# Altium project WanderDrive.PrjPcb (part 1 of 5)
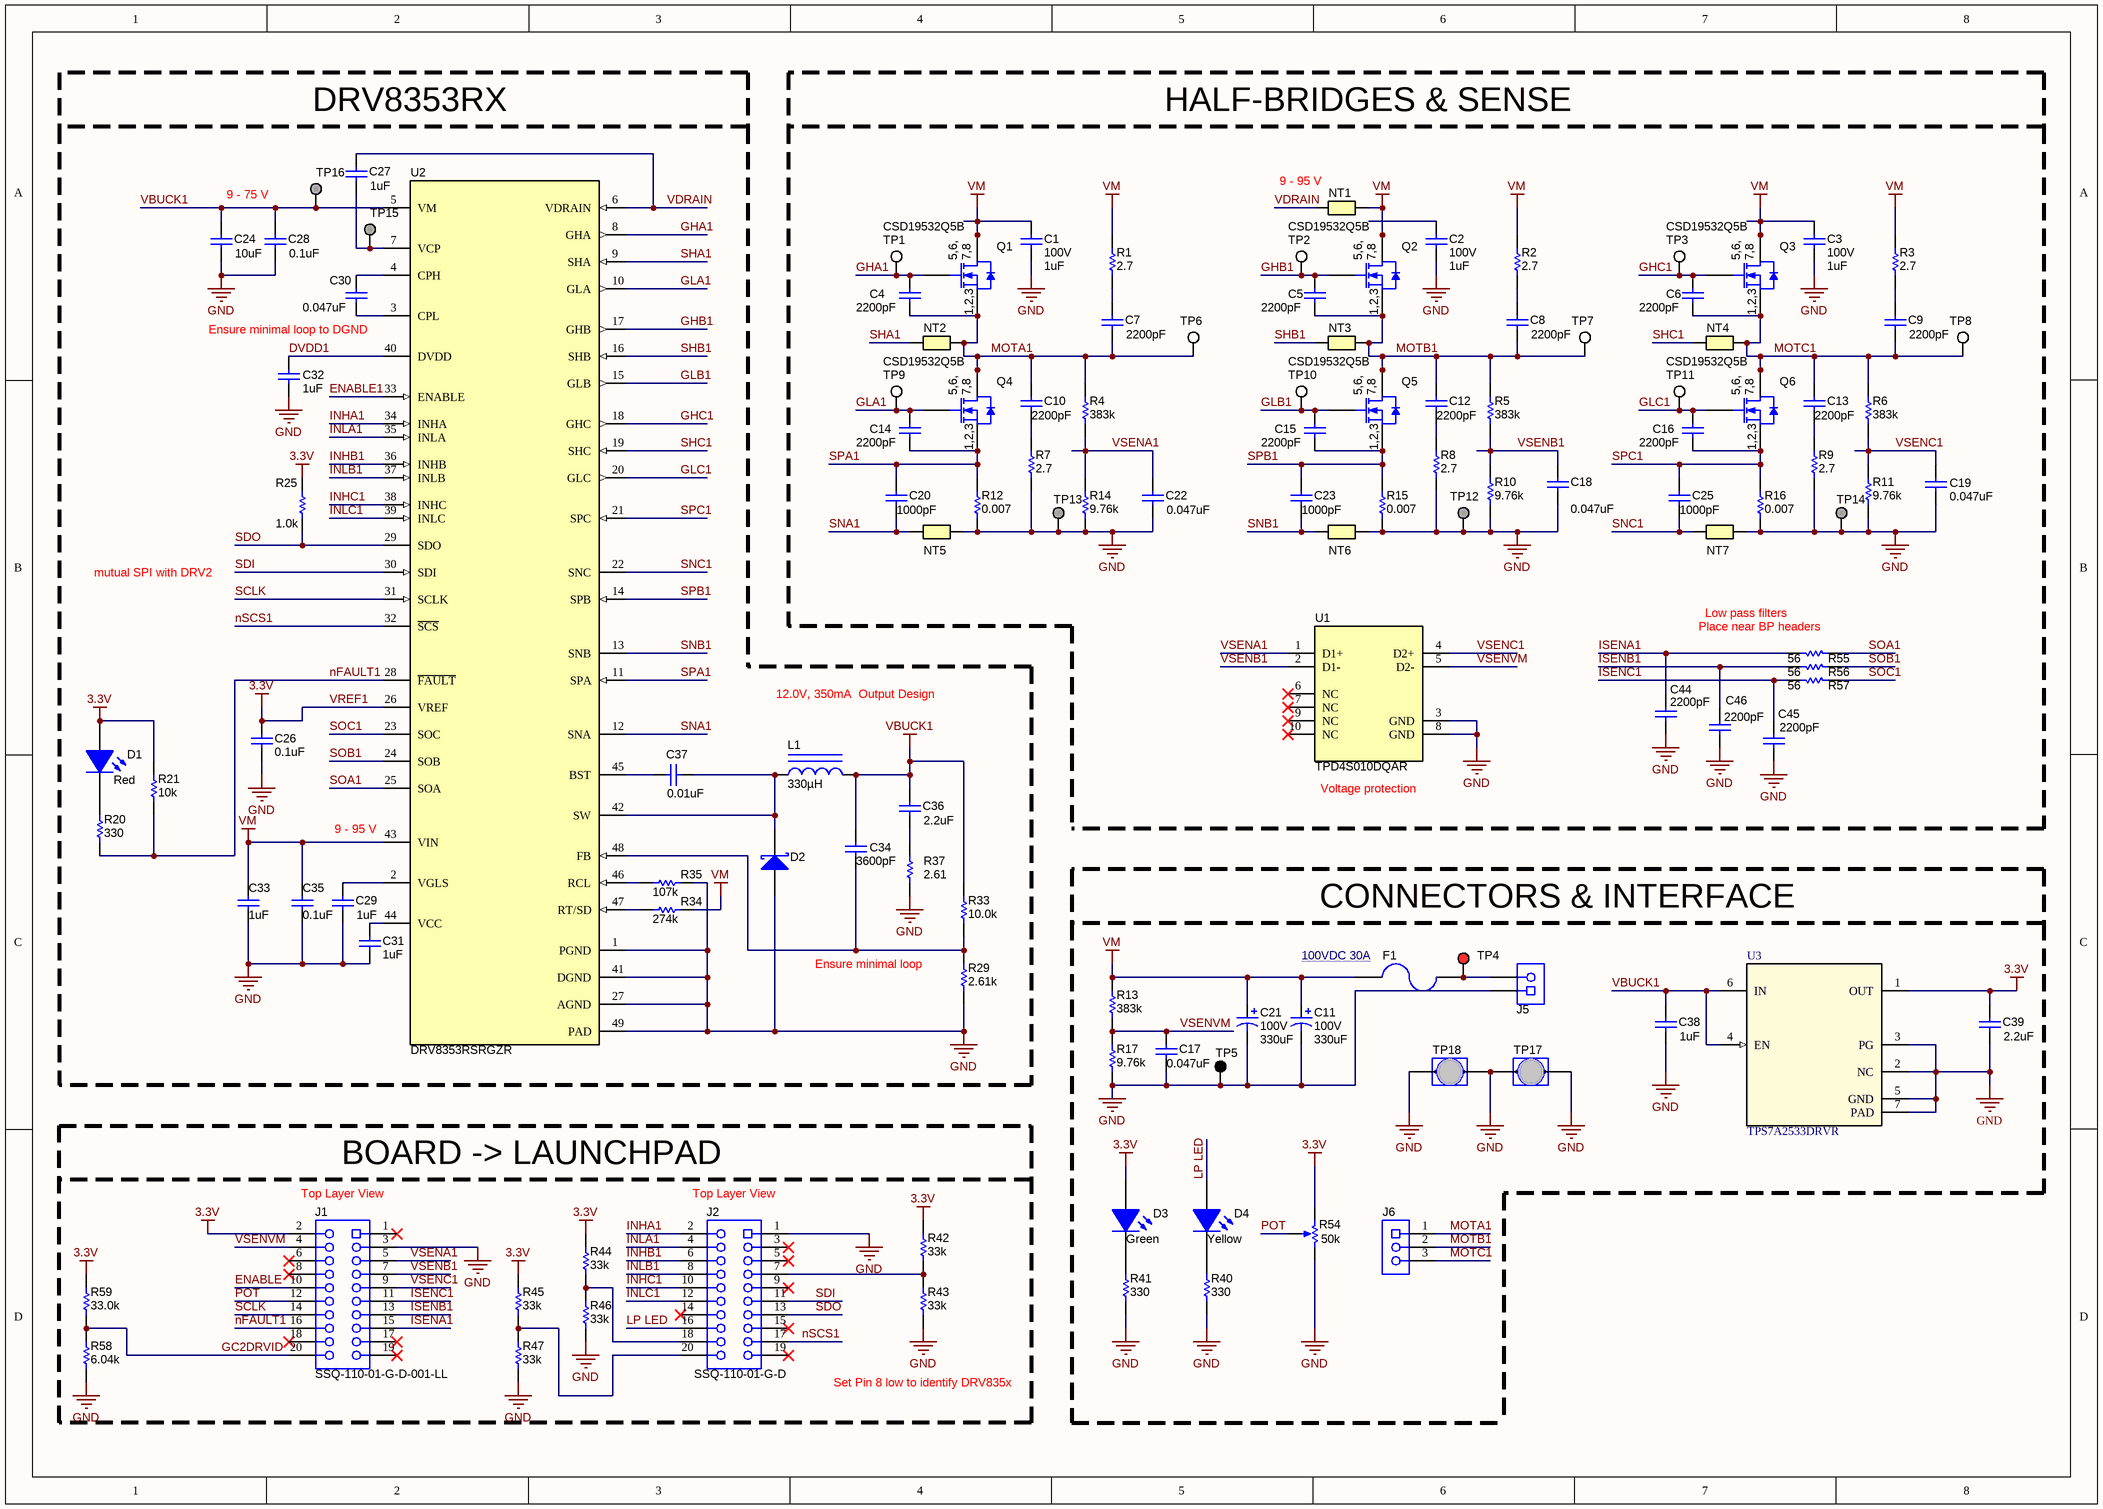
[diagram p0: WanderDrive_Gate_Driver_1.SchDoc]
AApp: NSI; ADate: 08/04/2020; Ades: Creation of WanderDrive, for a dynamic future; AEtabli: NSI; AInd: A0; AVerif: NSI; BoardName: WanderDrive; BoardRefNum: WAN_0036; BoardRev: A0
5 sheets, 407 parts. Net scope: flat (ports and power ports of the same name join across sheets).
Board file: WanderDrive.PcbDoc
Sheets:
  WanderDrive_Gate_Driver_1.SchDoc
  WanderDrive_Gate_Driver_2.SchDoc
  WanderDrive_AbsEnc.SchDoc
  WanderDrive_EtherCAT.SchDoc
  WanderDrive_Hardware.SchDoc

## Sheet WanderDrive_Gate_Driver_1.SchDoc
size A3; Date: Not shown in title block; ApprovedBy: Not shown in title block; CheckedBy: Not shown in title block; Author: Not shown in title block; CompanyName: Not shown in title block; Engineer: Not shown in title block; Organization: Not shown in title block; Address1: Not shown in title block; Address2: Not shown in title block; Address3: Not shown in title block; Address4: Not shown in title block; DocumentNumber: 1; Revision: Use project parameter SCH_Rev; SheetNumber: 1; SheetTotal: 4; PageSetup: Record=PageOptions|CenterHorizontal=True|CenterVertical=True|PrintScale=1.00|XCorrection=1.00|YCorrection=1.00|PrintKind=0|BorderSize=5000000|LeftOffset=0|BottomOffset=0|Orientation=2|PaperLength=1000|PaperWidth=1000|Scale=100|PaperSource=15|PrintQuality=600|MediaType=1|DitherType=10|PaperKind=Letter|PrintScaleMode=1; CurrentTime: Not shown in title block; CurrentDate: Not shown in title block; Time: Not shown in title block; DocumentFullPathAndName: Not shown in title block; DocumentName: Not shown in title block; ModifiedDate: Not shown in title block; ImagePath: Not shown in title block

### Parts
(Parts that share a designator on the sheet are numbered #1, #2 ... from top to bottom, then left to right.)
C1  VDC_V: 100V  ValueDisplayed: 1uF  [1206_180M]  (hidden comment: CL31B105KCHNNNE)
C2  VDC_V: 100V  ValueDisplayed: 1uF  [1206_180M]  (hidden comment: CL31B105KCHNNNE)
C3  VDC_V: 100V  ValueDisplayed: 1uF  [1206_180M]  (hidden comment: CL31B105KCHNNNE)
C4  ValueDisplayed: 2200pF  [0603_HV]  (hidden comment: 06031C222KAT2A)
C5  ValueDisplayed: 2200pF  [0603_HV]  (hidden comment: 06031C222KAT2A)
C6  ValueDisplayed: 2200pF  [0603_HV]  (hidden comment: 06031C222KAT2A)
C7  ValueDisplayed: 2200pF  [0603_HV]  (hidden comment: GRM188R72A222KA01D)
C8  ValueDisplayed: 2200pF  [0603_HV]  (hidden comment: GRM188R72A222KA01D)
C9  ValueDisplayed: 2200pF  [0603_HV]  (hidden comment: GRM188R72A222KA01D)
C10  ValueDisplayed: 2200pF  [0603_HV]  (hidden comment: GRM188R72A222KA01D)
C11  VDC_V: 100V  ValueDisplayed: 330uF  [SM_RADIAL_K16]  (hidden comment: EEV-FK2A331M)
C12  ValueDisplayed: 2200pF  [0603_HV]  (hidden comment: GRM188R72A222KA01D)
C13  ValueDisplayed: 2200pF  [0603_HV]  (hidden comment: GRM188R72A222KA01D)
C14  ValueDisplayed: 2200pF  [0603_HV]  (hidden comment: 06031C222KAT2A)
C15  ValueDisplayed: 2200pF  [0603_HV]  (hidden comment: 06031C222KAT2A)
C16  ValueDisplayed: 2200pF  [0603_HV]  (hidden comment: 06031C222KAT2A)
C17  ValueDisplayed: 0.047uF  [0603L]  (hidden comment: 06033C473JAT2A)
C18  ValueDisplayed: 0.047uF  [0603L]  (hidden comment: 06033C473JAT2A)
C19  ValueDisplayed: 0.047uF  [0603L]  (hidden comment: 06033C473JAT2A)
C20  ValueDisplayed: 1000pF  [0603L]  (hidden comment: 885012206034)
C21  VDC_V: 100V  ValueDisplayed: 330uF  [SM_RADIAL_K16]  (hidden comment: EEV-FK2A331M)
C22  ValueDisplayed: 0.047uF  [0603L]  (hidden comment: 06033C473JAT2A)
C23  ValueDisplayed: 1000pF  [0603L]  (hidden comment: 885012206034)
C24  ValueDisplayed: 10uF  [2220_280M]  (hidden comment: CGA9N3X7S2A106K230KE)
C25  ValueDisplayed: 1000pF  [0603L]  (hidden comment: 885012206034)
C26  ValueDisplayed: 0.1uF  [0603L]  (hidden comment: C0603C104J4RACTU)
C27  ValueDisplayed: 1uF  [1206_180M]  (hidden comment: CL31B105KCHNNNE)
C28  ValueDisplayed: 0.1uF  [0805_HV]  (hidden comment: C2012X7R2A104K125AA)
C29  ValueDisplayed: 1uF  [0603L]  (hidden comment: C1608X7R1C105K080AC)
C30  ValueDisplayed: 0.047uF  [0805_HV]  (hidden comment: C2012X7R2A473K125AA)
C31  ValueDisplayed: 1uF  [0603L]  (hidden comment: C1608X7R1C105K080AC)
C32  ValueDisplayed: 1uF  [0603L]  (hidden comment: EMK107B7105KA-T)
C33  ValueDisplayed: 1uF  [1206_180M]  (hidden comment: CL31B105KCHNNNE)
C34  ValueDisplayed: 3600pF  [0603L]  (hidden comment: GRM1885C1H362JA01D)
C35  ValueDisplayed: 0.1uF  [0805_HV]  (hidden comment: C2012X7R2A104K125AA)
C36  ValueDisplayed: 2.2uF  [0805L]  (hidden comment: C2012X7R1V225K085AC)
C37  ValueDisplayed: 0.01uF  [0603L]  (hidden comment: C0603C103K4RACTU)
C38  ValueDisplayed: 1uF  [0805L]  (hidden comment: CL21B105KBFNNNE)
C39  ValueDisplayed: 2.2uF  [1210_270L]  (hidden comment: GRM32ER71K475KE14L)
C44  ValueDisplayed: 2200pF  [0603L]  (hidden comment: GRM188R71C222KA01D)
C45  ValueDisplayed: 2200pF  [0603L]  (hidden comment: GRM188R71C222KA01D)
C46  ValueDisplayed: 2200pF  [0603L]  (hidden comment: GRM188R71C222KA01D)
D1  value Red  [LED_LTST-C170_Red]  (hidden comment: LTST-C170KRKT)
D2  DFLS1200-7  [PowerDI123]  (value not drawn)
D3  value Green  [LTST-C170KGKT_Green]  (hidden comment: LTST-C170KGKT)
D4  value Yellow  [LED_LTST-C170]  (hidden comment: LTST-C170KSKT)
F1  100VDC 30A  [Fuse_0463]
J1  SSQ-110-01-G-D-001-LL  [Samtec_SSQ-110-01-x-D-001-LL]
J2  SSQ-110-01-G-D  [Samtec_SSQ-110-01-x-D]
J5#1  1902547  [Phoenix_1902547]  (value not drawn)
J6#1  1904150  [Phoenix_1904150]  (value not drawn)
L1  ValueDisplayed: 330µH  [WE-LQS_8040]  (hidden comment: 74404084331)
NT1  Net-Tie  [Net-Tie_50milWide_30milLong]  (value not drawn)  (net tie, no BOM)
NT2  Net-Tie  [Net-Tie_10mil]  (value not drawn)  (net tie, no BOM)
NT3  Net-Tie  [Net-Tie_10mil]  (value not drawn)  (net tie, no BOM)
NT4  Net-Tie  [Net-Tie_10mil]  (value not drawn)  (net tie, no BOM)
NT5  Net-Tie  [Net-Tie_10mil]  (value not drawn)  (net tie, no BOM)
NT6  Net-Tie  [Net-Tie_10mil]  (value not drawn)  (net tie, no BOM)
NT7  Net-Tie  [Net-Tie_10mil]  (value not drawn)  (net tie, no BOM)
Q1  CSD19532Q5B  [DNK0008A]
Q2  CSD19532Q5B  [DNK0008A]
Q3  CSD19532Q5B  [DNK0008A]
Q4  CSD19532Q5B  [DNK0008A]
Q5  CSD19532Q5B  [DNK0008A]
Q6  CSD19532Q5B  [DNK0008A]
R1  ValueDisplayed: 2.7  [0805_HV]  (hidden comment: CRCW08052R70JNEA)
R2  ValueDisplayed: 2.7  [0805_HV]  (hidden comment: CRCW08052R70JNEA)
R3  ValueDisplayed: 2.7  [0805_HV]  (hidden comment: CRCW08052R70JNEA)
R4  ValueDisplayed: 383k  [0603_HV]  (hidden comment: CRCW0603383KFKEA)
R5  ValueDisplayed: 383k  [0603_HV]  (hidden comment: CRCW0603383KFKEA)
R6  ValueDisplayed: 383k  [0603_HV]  (hidden comment: CRCW0603383KFKEA)
R7  ValueDisplayed: 2.7  [0805_HV]  (hidden comment: CRCW08052R70JNEA)
R8  ValueDisplayed: 2.7  [0805_HV]  (hidden comment: CRCW08052R70JNEA)
R9  ValueDisplayed: 2.7  [0805_HV]  (hidden comment: CRCW08052R70JNEA)
R10  ValueDisplayed: 9.76k  [0603L]  (hidden comment: RC0603FR-079K76L)
R11  ValueDisplayed: 9.76k  [0603L]  (hidden comment: RC0603FR-079K76L)
R12  ValueDisplayed: 0.007  [CRE2512-R5_R9]  (hidden comment: CRE2512-FZ-R007E-3)
R13  ValueDisplayed: 383k  [0603_HV]  (hidden comment: CRCW0603383KFKEA)
R14  ValueDisplayed: 9.76k  [0603L]  (hidden comment: RC0603FR-079K76L)
R15  ValueDisplayed: 0.007  [CRE2512-R5_R9]  (hidden comment: CRE2512-FZ-R007E-3)
R16  ValueDisplayed: 0.007  [CRE2512-R5_R9]  (hidden comment: CRE2512-FZ-R007E-3)
R17  ValueDisplayed: 9.76k  [0603L]  (hidden comment: RC0603FR-079K76L)
R20  ValueDisplayed: 330  [0603L]  (hidden comment: CRCW0603330RJNEA)
R21  ValueDisplayed: 10k  [0603L]  (hidden comment: RC0603JR-0710KL)
R25  ValueDisplayed: 1.0k  [0603L]  (hidden comment: RCA06031K00JNEA)
R29  ValueDisplayed: 2.61k  [0603L]  (hidden comment: RG1608P-2611-B-T5)
R33  ValueDisplayed: 10.0k  [0603L]  (hidden comment: RG1608P-103-B-T5)
R34  ValueDisplayed: 274k  [0603_HV]  (hidden comment: RC0603FR-07274KL)
R35  ValueDisplayed: 107k  [0603L]  (hidden comment: RC0603FR-07107KL)
R37  ValueDisplayed: 2.61  [0603L]  (hidden comment: CRCW06032R61FKEA)
R40  ValueDisplayed: 330  [0603L]  (hidden comment: CRCW0603330RJNEA)
R41  ValueDisplayed: 330  [0603L]  (hidden comment: CRCW0603330RJNEA)
R42  ValueDisplayed: 33k  [0603L]  (hidden comment: Resistor)
R43  ValueDisplayed: 33k  [0603L]  (hidden comment: Resistor)
R44  ValueDisplayed: 33k  [0603L]  (hidden comment: Resistor)
R45  ValueDisplayed: 33k  [0603L]  (hidden comment: Resistor)
R46  ValueDisplayed: 33k  [0603L]  (hidden comment: Resistor)
R47  ValueDisplayed: 33k  [0603L]  (hidden comment: Resistor)
R54  value 50k  [Bourns_3352T]  (hidden comment: 3352T-1-503LF)
R55  value 56  [0603L]  (hidden comment: CRCW060356R0JNEA)
R56  value 56  [0603L]  (hidden comment: CRCW060356R0JNEA)
R57  value 56  [0603L]  (hidden comment: CRCW060356R0JNEA)
R58  ValueDisplayed: 6.04k  [0603L]  (hidden comment: RG1608P-6041-B-T5)
R59  ValueDisplayed: 33.0k  [0603L]  (hidden comment: MCT06030C3302FP500)
TP1  5002  [Keystone5002]  (value not drawn)
TP2  5002  [Keystone5002]  (value not drawn)
TP3  5002  [Keystone5002]  (value not drawn)
TP4  5000  [Keystone5000]  (value not drawn)
TP5  5001  [Keystone5001]  (value not drawn)
TP6  5002  [Keystone5002]  (value not drawn)
TP7  5002  [Keystone5002]  (value not drawn)
TP8  5002  [Keystone5002]  (value not drawn)
TP9  5002  [Keystone5002]  (value not drawn)
TP10  5002  [Keystone5002]  (value not drawn)
TP11  5002  [Keystone5002]  (value not drawn)
TP12  TP_SM_1MM  [TP_SM_1MM]  (value not drawn)  (no BOM)
TP13  TP_SM_1MM  [TP_SM_1MM]  (value not drawn)  (no BOM)
TP14  TP_SM_1MM  [TP_SM_1MM]  (value not drawn)  (no BOM)
TP15  TP_SM_1MM  [TP_SM_1MM]  (value not drawn)  (no BOM)
TP16  TP_SM_1MM  [TP_SM_1MM]  (value not drawn)  (no BOM)
TP17  D3082-05  [Harwin_D3082-05]  (value not drawn)
TP18  D3082-05  [Harwin_D3082-05]  (value not drawn)
U1  TPD4S010DQAR  [DQA0010A]
U2  DRV8353RSRGZR  [RGZ0048L]
U3  TPS7A2533DRVR  [DRV0006A]

### Blocks framed on the sheet
BOARD -> LAUNCHPAD: J1 J2 R42-R47 R58 R59

### Nets
GND: C1.1 C1.2 C2.2 C3.1 C3.2 C11.1(+) C11.2(-) C17.2 C18.2 C19.2 C21.1(+) C21.2(-) C22.2 C24.2 C26.2 C28.2 C29.2 C31.1 C32.2 C33.1 C33.2 C35.1 C35.2 C38.2 C39.2 C44.2 C45.2 C46.2 D2.2(A) F1.2 J1.3 J2.1 J5#1.1 NT1.2 NT5.2 NT6.2 NT7.2 Q1.5(D) Q1.6(D) Q1.7(D) Q1.8(D) Q1.9(D) Q2.5(D) Q2.6(D) Q2.7(D) Q2.8(D) Q2.9(D) Q3.5(D) Q3.6(D) Q3.7(D) Q3.8(D) Q3.9(D) R1.2 R2.2 R3.2 R7.1 R8.1 R9.1 R10.1 R11.1 R12.1 R13.2 R14.1 R15.1 R16.1 R17.1 R29.1 R34.2 R35.2 R37.1 R40.1 R41.1 R43.1 R46.1 R47.1 R54.1(CCW) R58.1 TP5.1 TP12.1 TP13.1 TP14.1 TP17.1 TP17.2 TP18.1 TP18.2 U1.3(GND) U1.8(GND) U2.1(PGND) U2.27(AGND) U2.41(DGND) U2.43(VIN) U2.49(PAD) U3.2(NC) U3.3(PG) U3.5(GND) U3.7(PAD)  [also labelled VM]
VBUCK1: C24.1 C28.1 C34.1 C36.1 C38.1 L1.2 R33.2 TP16.1 U2.5(VM) U3.4(EN) U3.6(IN)
VREF1: C26.1 C39.1 D1.1(A) D3.1(A) J1.2 R21.2 R25.2 R42.2 R44.2 R45.2 R54.3(CW) R59.2 U2.26(VREF) U3.1(OUT)  [also labelled 3.3V]
DVDD1: C32.1 U2.40(DVDD)
ENABLE: J1.10
ENABLE1: U2.33(ENABLE)
GC2DRVID: J1.20 R58.2 R59.1
GHA1: C4.1 Q1.4(G) TP1.1 U2.8(GHA)
GHB1: C5.1 Q2.4(G) TP2.1 U2.17(GHB)
GHC1: C6.1 Q3.4(G) TP3.1 U2.18(GHC)
GLA1: C14.1 Q4.4(G) TP9.1 U2.10(GLA)
GLB1: C15.1 Q5.4(G) TP10.1 U2.15(GLB)
GLC1: C16.1 Q6.4(G) TP11.1 U2.20(GLC)
INHA1: J2.2 U2.34(INHA)
INHB1: J2.6 U2.36(INHB)
INHC1: J2.10 U2.38(INHC)
INLA1: J2.4 U2.35(INLA)
INLB1: J2.8 U2.37(INLB)
INLC1: J2.12 U2.39(INLC)
ISENA1: C44.1 J1.15 R55.2
ISENB1: C46.1 J1.13 R56.2
ISENC1: C45.1 J1.11 R57.2
LP LED: D4.1(A) J2.16
MOTA1: C4.2 C7.2 C10.1 J6#1.1 NT2.2 Q1.1(S) Q1.2(S) Q1.3(S) Q4.5(D) Q4.6(D) Q4.7(D) Q4.8(D) Q4.9(D) R4.2 TP6.1
MOTB1: C5.2 C8.2 C12.1 J6#1.2 NT3.2 Q2.1(S) Q2.2(S) Q2.3(S) Q5.5(D) Q5.6(D) Q5.7(D) Q5.8(D) Q5.9(D) R5.2 TP7.1
MOTC1: C6.2 C9.2 C13.1 J6#1.3 NT4.2 Q3.1(S) Q3.2(S) Q3.3(S) Q6.5(D) Q6.6(D) Q6.7(D) Q6.8(D) Q6.9(D) R6.2 TP8.1
nFAULT1: J1.16 R20.1 R21.1 U2.28(~{FAULT})
nSCS1: J2.17 U2.32(~{SCS})
POT: J1.12 R54.2(WIPER)
SCLK: J1.14 U2.31(SCLK)
SDI: J2.11 U2.30(SDI)
SDO: J2.13 R25.1 U2.29(SDO)
SHA1: NT2.1 U2.9(SHA)
SHB1: NT3.1 U2.16(SHB)
SHC1: NT4.1 U2.19(SHC)
SNA1: C20.2 NT5.1 U2.12(SNA)
SNB1: C23.2 NT6.1 U2.13(SNB)
SNC1: C25.2 NT7.1 U2.22(SNC)
SOA1: R55.1 U2.25(SOA)
SOB1: R56.1 U2.24(SOB)
SOC1: R57.1 U2.23(SOC)
SPA1: C14.2 C20.1 Q4.1(S) Q4.2(S) Q4.3(S) R12.2 U2.11(SPA)
SPB1: C15.2 C23.1 Q5.1(S) Q5.2(S) Q5.3(S) R15.2 U2.14(SPB)
SPC1: C16.2 C25.1 Q6.1(S) Q6.2(S) Q6.3(S) R16.2 U2.21(SPC)
VDRAIN: C27.1 NT1.1 U2.6(VDRAIN)
VSENA1: C22.1 J1.5 R4.1 R14.2 U1.1(D1+)
VSENB1: C18.1 J1.7 R5.1 R10.2 U1.2(D1-)
VSENC1: C19.1 J1.9 R6.1 R11.2 U1.4(D2+)
VSENVM: C17.1 J1.4 R13.1 R17.2 U1.5(D2-)
NetC7_1: C7.1 R1.1
NetC8_1: C8.1 R2.1
NetC9_1: C9.1 R3.1
NetC10_2: C10.2 R7.2
NetC12_2: C12.2 R8.2
NetC13_2: C13.2 R9.2
NetC27_2: C27.2 TP15.1 U2.7(VCP)
NetC29_1: C29.1 U2.2(VGLS)
NetC30_1: C30.1 U2.4(CPH)
NetC30_2: C30.2 U2.3(CPL)
NetC31_2: C31.2 U2.44(VCC)
NetC34_2: C34.2 R29.2 R33.1 U2.48(FB)
NetC36_2: C36.2 R37.2
NetC37_1: C37.1 D2.1(K) L1.1 U2.42(SW)
NetC37_2: C37.2 U2.45(BST)
NetD1_2: D1.2(K) R20.2
NetD3_2: D3.2(K) R41.2
NetD4_2: D4.2(K) R40.2
NetF1_1: F1.1 J5#1.2 TP4.1
NetJ2_7: J2.7 R42.1 R43.2
NetJ2_18: J2.18 R44.1 R46.2
NetJ2_20: J2.20 R45.1 R47.2
NetR34_1: R34.1 U2.47(RT/SD)
NetR35_1: R35.1 U2.46(RCL)

Not connected (* = marked no-connect by the designer): C2 1; J1 1* 6* 8* 17* 18* 19*; J2 3* 5* 9* 14* 15* 19*; U1 6(NC)* 7(NC)* 9(NC)* 10(NC)*

### Notes on the sheet
- (near C27) DRV8353RX
- HALF-BRIDGES & SENSE
- (near NT1) 9 - 95 V
- 9 - 75 V
- Ensure minimal loop to DGND
- mutual SPI with DRV2
- Low pass filters
- Place near BP headers
- 12.0V, 350mA  Output Design
- (near U1) Voltage protection
- (near U2) 9 - 95 V
- CONNECTORS & INTERFACE
- Ensure minimal loop
- (near J1) Top Layer View
- (near J2) Top Layer View
- Set Pin 8 low to identify DRV835x
- Title
- Size:
- Date:
- A3
- Number:
- Time:
- Revision:
- Sheet
- of
- File:
- (in symbol CMP-0000958-3) 5,6,; 7,8; 1,2,3